# Altium schematic sheet CW308_Connectors.SchDoc: IO Connectors
size Letter; ApprovedBy: N; Organization: NewAE Technology Inc.; Address1: 1083 Queen St., Suite 196; Address2: Halifax; Address3: NS; Address4: Canada B3H 0B2; DocumentNumber: 2; SheetNumber: 2; SheetTotal: 5; SheetApproved: YES
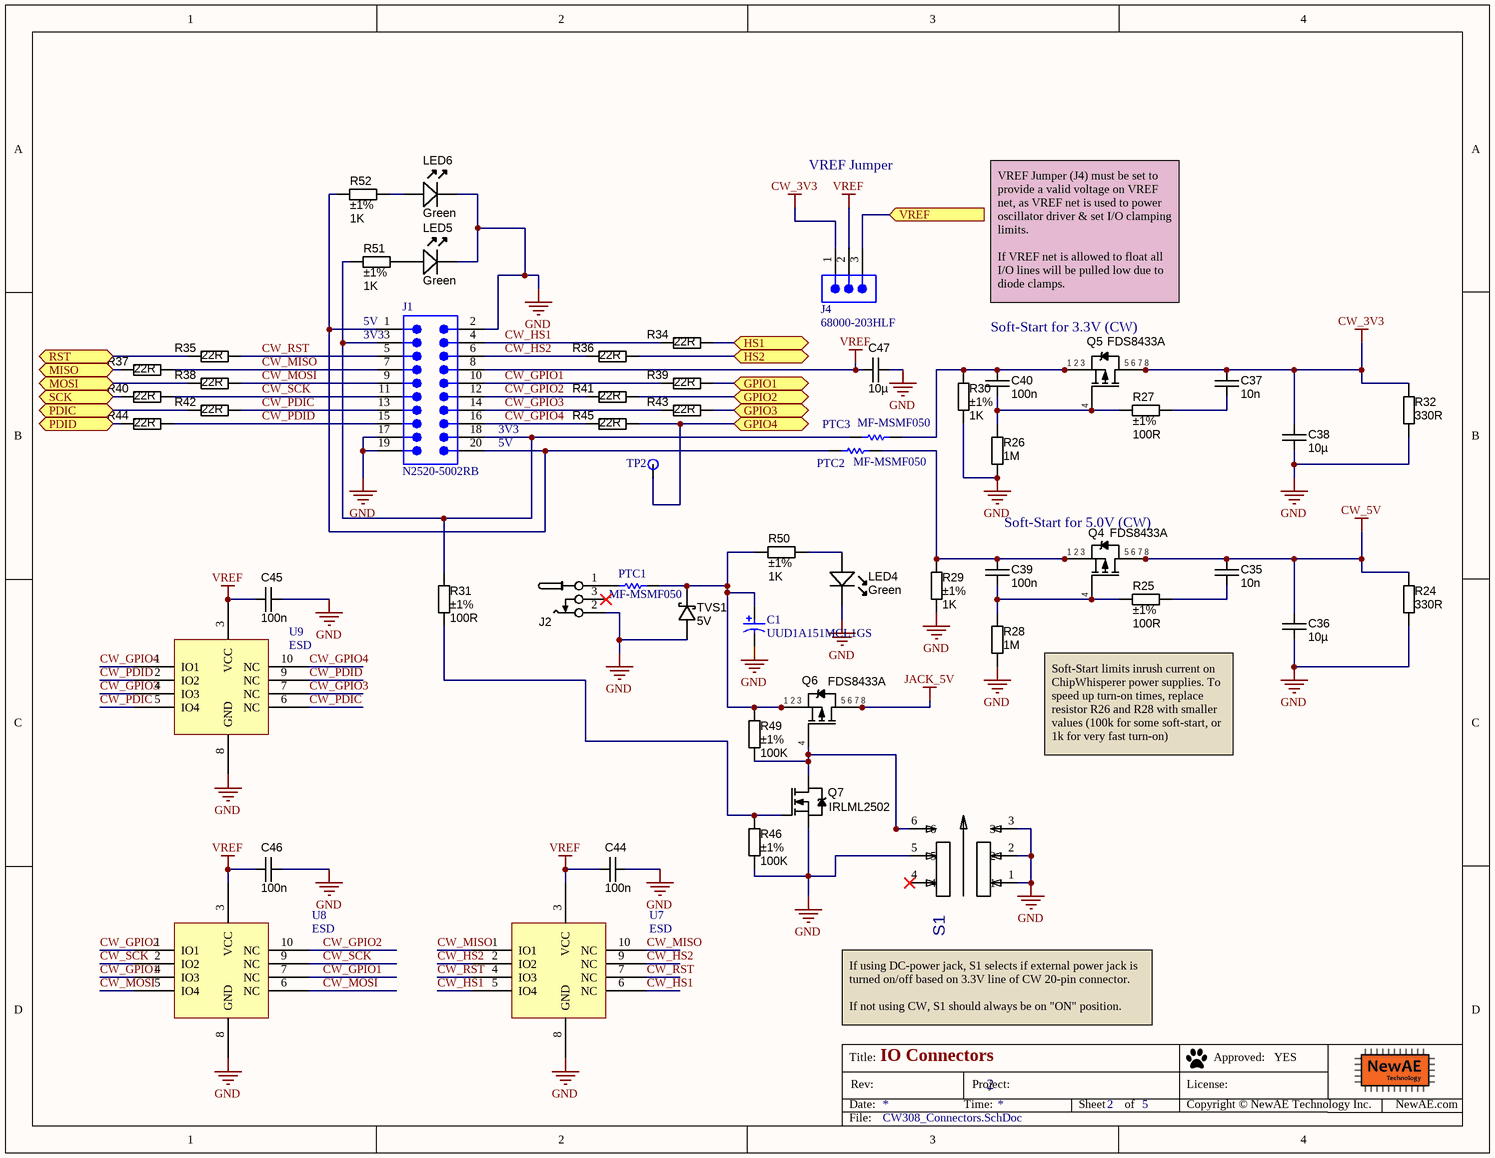
[diagram p0: CW308_Connectors.SchDoc]

## Parts
C1  UUD1A151MCL1GS  [NIC-CAPA2-6.3X5.8_V]
C35  value 10n  [CAPC1608X90N]  (hidden comment: approved sub OK)
C36  value 10µ  [CAPC2012X135N]  (hidden comment: approved sub OK)
C37  value 10n  [CAPC1608X90N]  (hidden comment: approved sub OK)
C38  value 10µ  [CAPC2012X135N]  (hidden comment: approved sub OK)
C39  value 100n  [CAPC1608X90N]  (hidden comment: approved sub OK)
C40  value 100n  [CAPC1608X90N]  (hidden comment: approved sub OK)
C44  value 100n  [CAPC1608X90N]  (hidden comment: approved sub OK)
C45  value 100n  [CAPC1608X90N]  (hidden comment: approved sub OK)
C46  value 100n  [CAPC1608X90N]  (hidden comment: approved sub OK)
C47  value 10µ  [CAPC2012X135N]  (hidden comment: approved sub OK)
J1  N2520-5002RB  [NAE-PCB-CW-1000-0001-01]
J2  CONN_PWR_JACK_2.1x5.5mm  [CONN_PWR_JACK_2.1x5.5mm]  (value not drawn)
J4  68000-203HLF  [SMTC-TSW-103-07-X-S]
LED4  Green  [LED-0603-GREEN]
LED5  Green  [LED-0603-GREEN]
LED6  Green  [LED-0603-GREEN]
PTC1  MF-MSMF050  [BOUR-MF-MSMF050-2_V]
PTC2  MF-MSMF050  [BOUR-MF-MSMF050-2_V]
PTC3  MF-MSMF050  [BOUR-MF-MSMF050-2_V]
Q4  FDS8433A  [SOIC127P600X175-8AN]
Q5  FDS8433A  [SOIC127P600X175-8AN]
Q6  FDS8433A  [SOIC127P600X175-8AN]
Q7  IRLML2502  [SOT23-3]
R24  value 330R  [RESC1608X55N]  (hidden comment: Thick Film)
R25  value 100R  Tolerance: ±1%  [RESC1608X55N]  (hidden comment: Thick Film)
R26  value 1M  [RESC1608X55N]  (hidden comment: Thick Film)
R27  value 100R  Tolerance: ±1%  [RESC1608X55N]  (hidden comment: Thick Film)
R28  value 1M  [RESC1608X55N]  (hidden comment: Thick Film)
R29  value 1K  Tolerance: ±1%  [RESC1608X55N]  (hidden comment: Thick Film)
R30  value 1K  Tolerance: ±1%  [RESC1608X55N]  (hidden comment: Thick Film)
R31  value 100R  Tolerance: ±1%  [RESC1608X55N]  (hidden comment: Thick Film)
R32  value 330R  [RESC1608X55N]  (hidden comment: Thick Film)
R34  value 22R  [RESC1608X55N]  (hidden comment: Thick Film)
R35  value 22R  [RESC1608X55N]  (hidden comment: Thick Film)
R36  value 22R  [RESC1608X55N]  (hidden comment: Thick Film)
R37  value 22R  [RESC1608X55N]  (hidden comment: Thick Film)
R38  value 22R  [RESC1608X55N]  (hidden comment: Thick Film)
R39  value 22R  [RESC1608X55N]  (hidden comment: Thick Film)
R40  value 22R  [RESC1608X55N]  (hidden comment: Thick Film)
R41  value 22R  [RESC1608X55N]  (hidden comment: Thick Film)
R42  value 22R  [RESC1608X55N]  (hidden comment: Thick Film)
R43  value 22R  [RESC1608X55N]  (hidden comment: Thick Film)
R44  value 22R  [RESC1608X55N]  (hidden comment: Thick Film)
R45  value 22R  [RESC1608X55N]  (hidden comment: Thick Film)
R46  value 100K  Tolerance: ±1%  [RESC1608X55N]  (hidden comment: Thick Film)
R49  value 100K  Tolerance: ±1%  [RESC1608X55N]  (hidden comment: Thick Film)
R50  value 1K  Tolerance: ±1%  [RESC1608X55N]  (hidden comment: Thick Film)
R51  value 1K  Tolerance: ±1%  [RESC1608X55N]  (hidden comment: Thick Film)
R52  value 1K  Tolerance: ±1%  [RESC1608X55N]  (hidden comment: Thick Film)
S1  JS202011SCQN  [SW_JS202011SCQN]  (value not drawn)
TP2  5008  [KEYSTONE5008]  (value not drawn)
TVS1  Ratings: 5V  [DO-214AC]  (hidden comment: DIODE_TVS_5V)
U7  ESD  [MSOP10]
U8  ESD  [MSOP10]
U9  ESD  [MSOP10]

## Ports
GPIO1 (bidir), GPIO2 (bidir), GPIO3 (bidir), GPIO4 (bidir), HS1 (bidir), HS2 (bidir), MISO (bidir), MOSI (bidir), PDIC (bidir), PDID (bidir), RST (bidir), SCK (bidir), VREF (in)

## Nets
CW_3V3: C37.1 C38.1 J4.1 Q5.5(5,6,7,8) Q5.6(D) Q5.7(D) Q5.8(D) R32.2
CW_5V: C35.1 C36.1 Q4.5(5,6,7,8) Q4.6(D) Q4.7(D) Q4.8(D) R24.2
GND: C1.2 C36.2 C38.2 C44.2 C45.2 C46.2 C47.2 J1.2 J1.17 J1.19 J2.2 LED4.K LED5.K LED6.K Q7.2(S) R24.1 R26.1 R28.1 R29.1 R30.1 R32.1 R46.2 S1.1 S1.2 S1.3 S1.5 TVS1.A U7.8(GND) U8.8(GND) U9.8(GND)
JACK_5V: Q6.5(5,6,7,8) Q6.6(D) Q6.7(D) Q6.8(D)
VREF: C44.1 C45.1 C46.1 C47.1 J1.8 J4.2 U7.3(VCC) U8.3(VCC) U9.3(VCC)
CW_GPIO1: J1.10 R39.1 U8.4(IO3) U8.7(NC)
CW_GPIO2: J1.12 R41.1 U8.1(IO1) U8.10(NC)
CW_GPIO3: J1.14 R43.1 U9.4(IO3) U9.7(NC)
CW_GPIO4: J1.16 R45.1 U9.1(IO1) U9.10(NC)
CW_HS1: J1.4 R34.1 U7.5(IO4) U7.6(NC)
CW_HS2: J1.6 R36.1 U7.2(IO2) U7.9(NC)
CW_MISO: J1.7 R37.2 U7.1(IO1) U7.10(NC)
CW_MOSI: J1.9 R38.2 U8.5(IO4) U8.6(NC)
CW_PDIC: J1.13 R42.2 U9.5(IO4) U9.6(NC)
CW_PDID: J1.15 R44.2 U9.2(IO2) U9.9(NC)
CW_RST: J1.5 R35.2 U7.4(IO3) U7.7(NC)
CW_SCK: J1.11 R40.2 U8.2(IO2) U8.9(NC)
GPIO1: R39.2 ; port GPIO1
GPIO2: R41.2 ; port GPIO2
GPIO3: R43.2 ; port GPIO3
GPIO4: R45.2 TP2.1 ; port GPIO4
HS1: R34.2 ; port HS1
HS2: R36.2 ; port HS2
MISO: R37.1 ; port MISO
MOSI: R38.1 ; port MOSI
PDIC: R42.1 ; port PDIC
PDID: R44.1 ; port PDID
RST: R35.1 ; port RST
SCK: R40.1 ; port SCK
VREF: J4.3 ; port VREF  [a separate net that carries the same name]
NetC1_1: C1.1 PTC1.2 Q6.1(1,2,3) Q6.2(S) Q6.3(S) R49.1 R50.2 TVS1.K
NetC35_2: C35.2 R25.2
NetC37_2: C37.2 R27.2
NetC39_1: C39.1 PTC2.2 Q4.1(1,2,3) Q4.2(S) Q4.3(S) R29.2
NetC39_2: C39.2 Q4.4(G) R25.1 R28.2
NetC40_1: C40.1 PTC3.2 Q5.1(1,2,3) Q5.2(S) Q5.3(S) R30.2
NetC40_2: C40.2 Q5.4(G) R26.2 R27.1
NetJ1_1: J1.1 J1.20 PTC2.1 R52.2
NetJ1_3: J1.3 J1.18 PTC3.1 R31.2 R51.2
NetJ2_1: J2.1 PTC1.1
NetLED4_A: LED4.A R50.1
NetLED5_A: LED5.A R51.1
NetLED6_A: LED6.A R52.1
NetQ6_4: Q6.4(G) Q7.3(D) R49.2 S1.6
NetQ7_1: Q7.1(G) R31.1 R46.1

Not connected (* = marked no-connect by the designer): J2 3*; S1 4*

## Notes on the sheet
- VREF Jumper
- VREF Jumper (J4) must be set to provide a valid voltage on VREF net, as VREF net is used to power oscillator driver & set I/O clamping limits.
  If VREF net is allowed to float all I/O lines will be pulled low due to diode clamps.
- (near J1) 5V
- (near J1) 3V3
- Soft-Start for 3.3V (CW)
- Soft-Start for 5.0V (CW)
- Soft-Start limits inrush current on ChipWhisperer power supplies. To speed up turn-on times, replace resistor R26 and R28 with smaller values (100k for some soft-start, or 1k for very fast turn-on)
- If using DC-power jack, S1 selects if external power jack is turned on/off based on 3.3V line of CW 20-pin connector.
  If not using CW, S1 should always be on "ON" position.
- Title:
- Date:
- Rev:
- Time:
- Project:
- Sheet
- of
- License:
- Copyright © NewAE Technology Inc.
- Approved:
- NewAE.com
- File:

## Library data of the parts
C1 = CMP-0687-00052-1: Aluminum Electrolytic Capacitor, UD Series, Low Impedance, 150 uF, 10 V, + / - 20%, -55 to 105 degC, Chip Type, 6.3 x 5.8 mm D x L, Pb-Free, Reel; Manufacturer: Nichicon; Tolerance Rated Capacitance: -20 to 20%; Endurance Time: 2000 h; Rated Voltage: 10 V; Impedance: 0.44 Ohm; Rated Capacitance: 150 uF; Rated Ripple Current (at 100kHz): 230 mA; Packing: Dia382mm Reel; RoHS: TRUE; ComponentLink1URL: http://www.nichicon.co.jp/; Mounting Technology: Surface Mount; Length: 5.8 mm; ComponentLink3URL: http://products.nichicon.co.jp/en/pdf/XJA043/e-ud.pdf; ComponentLink1Description: Manufacturer URL; ComponentLink2URL: http://products.nichicon.co.jp/en/pdf/XJA043/e-ud.pdf; DatasheetVersion: 08/2012; ComponentLink3Description: Package Specification; ComponentLink2Description: Datasheet; PartNumber: UUD1A151MCL1GS; Diameter: 6.3 mm; PackageDescription: 2-Pin Surface Mount Device, Diameter 6.3 mm, Height 5.8 mm, Pitch 5.4 mm; PackageReference: CAPAE-D6.3H5.8; Supplier 1: Digi-Key; Supplier Part Number 1: 493-2249-1-ND
C35 C37 = CAPC_10n_0603_X7R_50V_10%: Capacitor SMD Cer 10nF 10% 50V X7R 0603; Manufacturer 1: TDK Corporation; Manufacturer Part Number 1: C1608X7R1H103K; Ratings: 50V; X7R; Material: ceramic; SCDType: spec; Package / Case: 0603 (1608 metric); Tolerance: ±10%; Supplier 1: Digi-Key; Supplier Part Number 1: 445-1311-1-ND; ComponentLink1URL: http://product.tdk.com/capacitor/mlcc/en/documents/mlcc_commercial_general_en.pdf; ComponentLink1Description: http://product.tdk.com/capacitor/mlcc/en/documents/mlcc_commercial_general_en.pdf; Supplier 2: Digi-Key; Supplier Part Number 2: 478-1227-1-ND; Manufacturer 2: AVX Corporation; Manufacturer Part Number 2: 06035C103KAT2A; ComponentLink2URL: http://www.avx.com/docs/Catalogs/cx7r.pdf; ComponentLink2Description: http://www.avx.com/docs/Catalogs/cx7r.pdf
C36 C38 C47 = CAPC_10u_0805_10V: Capacitor SMD Cer 10uF 10% 10V X5R 0805; Manufacturer 1: AVX Corporation; Manufacturer Part Number 1: 0805ZD106KAT2A; Ratings: 10V; X5R; Material: ceramic; SCDType: spec; Package / Case: 0805 (2012 metric); Tolerance: ±10%; Manufacturer 2: Kemet; Manufacturer Part Number 2: C0805C106K8PACTU; Supplier 1: Digi-Key; Supplier Part Number 1: 478-5167-1-ND; ComponentLink1URL: http://www.avx.com/docs/Catalogs/cx5r.pdf; ComponentLink1Description: http://www.avx.com/docs/Catalogs/cx5r.pdf; ComponentLink2URL: http://www.kemet.com/datasheets&C0805C106K8PACTU; ComponentLink2Description: http://www.kemet.com/datasheets&C0805C106K8PACTU; Supplier 2: Digi-Key; Supplier Part Number 2: 399-4925-1-ND
C39 C40 C44-C46 = CAPC_100n_0603_X7R_50V_10%: Capacitor SMD Cer 100nF 10% 50V X7R 0603; Manufacturer 1: AVX Corporation; Manufacturer Part Number 1: 06035C104KAT2A; Ratings: 50V; X7R; Material: ceramic; SCDType: spec; Manufacturer 2: TDK Corporation; Manufacturer Part Number 2: C1608X7R1H104K; Package / Case: 0603 (1608 Metric); Tolerance: ±10%; Supplier 1: Digi-Key; Supplier Part Number 1: 478-5052-1-ND; ComponentLink1URL: http://www.avx.com/docs/Catalogs/cx7r.pdf; ComponentLink1Description: http://www.avx.com/docs/Catalogs/cx7r.pdf; Supplier 2: Digi-Key; Supplier Part Number 2: 445-1314-1-ND; ComponentLink2URL: http://product.tdk.com/capacitor/mlcc/en/documents/mlcc_commercial_general_en.pdf; ComponentLink2Description: http://product.tdk.com/capacitor/mlcc/en/documents/mlcc_commercial_general_en.pdf
J1 = NAE-CW-1000-0001-01: 20 Pin R/A Shrouded Header; Manufacturer: 3M; Pitch: 2.54 mm; PackageReference: N2520-5002RB; PackageDescription: .100[2.54] High Temp Terminal Body (Board Stacking); Orientation: Vertical; RoHS: True; Temperature Range: -55 to 125 degC; Mounting Technology: Through-hole; PartNumber: N2520-5002RB; Supplier 1: Digi-Key; Supplier Part Number 1: MHE20K-ND
J2 = CONN_PWR_JACK_2.1x5.5mm: Power Connector, THT, 2.1mm ID, 5.5mm OD; Manufacturer 1: CUI Inc; Manufacturer Part Number 1: PJ-102AH; SCDType: undef; Category: Connectors; Mounting Type: Through Hole; Package / Case: PCB mount; Value: 2.1mm ID, 5.5mm OD; Supplier 1: Digi-Key; Supplier Part Number 1: CP-102AH-ND
J4 = CMP-1024-00333-1: Manufacturer: Samtec; Pitch: 2.54 mm; Temperature Range: -55 to 125 degC; RoHS: True; Orientation: Vertical; PackageDescription: .025[0.64] SQ. Post Terminal Strip Assembly; Mounting Technology: Through-hole; PartNumber: 68000-203HLF; Supplier 1: Digi-Key; Supplier Part Number 1: 609-3464-ND
LED4-LED6 = LED_SMD_Green_0603_570nm: LED 0603 SMD Green 570nm 50mcd 20mA; Manufacturer 1: Kingbright Company LLC; Manufacturer Part Number 1: APT1608CGCK; Material: AlGaInP; Ratings: 20mcd min; 50 mcd typ; 570 nm; Voltage - Forward (Vf) Typ: 2.1V; Viewing Angle: 120°; Lens Style/Size: Rectangle with Flat Top, 1.1mm x 0.8mm; Voltage - Forward (Vf) @ 10mA: 2.0V; SCDType: source; Wavelength - Peak: 574nm; Lens Type: Clear; Package / Case: 0603 (1608 metric); Color: Green; Current - Test: 20mA; Supplier 1: Digi-Key; Supplier Part Number 1: 754-1116-1-ND; RoHS 1: RoHS Compliant; Wavelength - Dominant: 570nm; ComponentLink1URL: http://www.us.kingbright.com/images/catalog/SPEC/APT1608CGCK.pdf; ComponentLink1Description: http://www.us.kingbright.com/images/catalog/SPEC/APT1608CGCK.pdf
PTC1-PTC3 = CMP-0280-00002-2: MF-MSMF Series - PTC Resettable Fuse, 15 V Max, 0.15 Ohm Min, -40 to 85 degC, RoHS, Reel; Manufacturer: Bourns; Voltage DC (Max): 15 V; Trip Current: 1 A; Hold Current: 0.5 A; Current Rating (Max): 100 A; ComponentLink1Description: Manufacturer URL; Operating Temperature Range: -40 to 85 degC; ComponentLink2URL: http://www.bourns.com/data/global/pdfs/mfmsmf.pdf; PackageReference: MF-MSMF050; ComponentLink2Description: Datasheet; PartNumber: MF-MSMF050; DatasheetVersion: Rev. AD; ComponentLink3URL: http://www.bourns.com/data/global/pdfs/mfmsmf.pdf; ComponentLink3Description: Package Specification; RoHS: TRUE; PackageDescription: 2-Pin SMD, Body 4.55 x 3.24 mm; Mounting Technology: Surface Mount; Packing: Reel; Resistance (Min): 0.15 Ohm; ComponentLink1URL: http://www.bourns.com/; Supplier 1: Digi-Key; Supplier Part Number 1: MF-MSMF050-2CT-ND
Q4-Q6 = MOSFET_FDS8433A: MOSFET P-CH 30V 13.7A SOIC-8 SMD, LL-Gate Drive; Manufacturer 1: Fairchild Semiconductor; Material: Silicon; Ratings: 30V; 5A; SCDType: source; Package / Case: SOIC-8; Manufacturer Part Number 1: FDS8433A; ComponentLink1Description: Datasheet; ComponentLink1URL: http://www.fairchildsemi.com/datasheets/FD/FDS8433A.pdf; Supplier 1: Digi-Key; Supplier Part Number 1: FDS8433ACT-ND
Q7 = MOSFET_IRLML2502: MOSFET SMD N-CH 20V 4.2A SOT23-3; Manufacturer 1: Diodes Inc; Manufacturer Part Number 1: IRLML2502TRPBF; Ratings: 20V; 4.2A; Material: Metal Oxide; SCDType: source; Package / Case: SOT23-3; Supplier 1: Digi-Key; Supplier Part Number 1: IRLML2502PBFCT-ND
R24 R32 = RES_330R_0603_5%: Resistor SMD chip 330 Ohm 0.1W 5% 0603; Manufacturer 1: Vishay Dale; Manufacturer Part Number 1: CRCW0603330RJNEA; Ratings: 1/10 W; SCDType: spec; Manufacturer 2: Yageo; Manufacturer Part Number 2: RC0603JR-07330RL; Package / Case: 0603 (1608 metric); Tolerance: ±5%; Material: Thick Film; Supplier 1: Digi-Key; Supplier Part Number 1: 541-330GCT-ND; ComponentLink1URL: http://www.vishay.com/doc?20035; ComponentLink1Description: http://www.vishay.com/doc?20035; Supplier 2: Digi-Key; Supplier Part Number 2: 311-330GRCT-ND; ComponentLink2URL: http://www.yageo.com/documents/recent/PYu-RC0603_51_RoHS_L_4.pdf; ComponentLink2Description: http://www.yageo.com/documents/recent/PYu-RC0603_51_RoHS_L_4.pdf
R25 R27 R31 = RES_100R_0603_1%: Resistor SMD chip 100 Ohm 0.1W 1% 0603; Manufacturer 1: Yageo; Manufacturer Part Number 1: RC0603FR-07100RL; Ratings: 1/10 W; SCDType: spec; Package / Case: 0603 (1608 Metric); Material: Thick Film; Supplier 1: Digi-Key; Supplier Part Number 1: 311-100HRCT-ND; Supplier 2: Digi-Key; Supplier Part Number 2: P100HTR-ND; Manufacturer 2: Panasonic - ECG; Manufacturer Part Number 2: ERJ-3EKF1000V; ComponentLink1URL: http://industrial.panasonic.com/www-cgi/jvcr13pz.cgi?E+PZ+3+AOA0002+ERJ3EKF1000V+7+WW; ComponentLink1Description: http://industrial.panasonic.com/www-cgi/jvcr13pz.cgi?E+PZ+3+AOA0002+ERJ3EKF1000V+7+WW
R26 R28 = RES_1M_0603_5%: Resistor SMD chip 1M Ohm 0.1W 5% 0603; Manufacturer 1: Vishay Dale; Manufacturer Part Number 1: CRCW06031M00JNEA; Ratings: 1/10 W; SCDType: spec; Package / Case: 0603 (1608 metric); Tolerance: ±5%; Material: Thick Film; Supplier 1: Digi-Key; Supplier Part Number 1: 541-1.0MGCT-ND; ComponentLink1URL: http://www.vishay.com/doc?20008; ComponentLink1Description: http://www.vishay.com/doc?20008; Supplier 2: Digi-Key; Supplier Part Number 2: 311-1.0MGRCT-ND; ComponentLink2URL: http://www.yageo.com/documents/recent/PYu-RC0603_51_RoHS_L_4.pdf; ComponentLink2Description: http://www.yageo.com/documents/recent/PYu-RC0603_51_RoHS_L_4.pdf; Manufacturer 2: Yageo; Manufacturer Part Number 2: RC0603JR-071ML
R29 R30 R50-R52 = RES_1K_0603_1%: Resistor SMD chip 1k Ohm 0.1W 1% 0603; Manufacturer 1: Yageo; Manufacturer Part Number 1: RC0603FR-071KL; Ratings: 1/10W; SCDType: spec; Package / Case: 0603 (1608 Metric); Supplier 1: Digi-Key; Supplier Part Number 1: 311-1.00KHRCT-ND
R34-R45 = RES_22R_0603_5%: Resistor SMD chip 22 Ohm 0.1W 5% 0603; Manufacturer 1: Yageo; Manufacturer Part Number 1: RC0603JR-0722RL; Ratings: 1/10W; SCDType: spec; Temperature Coefficient: ±100ppm/°C; Tolerance: ±5%; Package / Case: 0603 (1608 metric); Case: 0603 (1608 metric); Supplier 1: Digi-Key; Supplier Part Number 1: 311-22GRCT-ND; RoHS 1: RoHS Compliant; ComponentLink1URL: http://www.yageo.com/documents/recent/PYu-RC0603_51_RoHS_L_4.pdf; ComponentLink1Description: http://www.yageo.com/documents/recent/PYu-RC0603_51_RoHS_L_4.pdf; Supplier 2: Digi-Key; Supplier Part Number 2: 1276-5022-6-ND; Manufacturer 2: Samsung Electro-Mechanics America, Inc; Manufacturer Part Number 2: RC1608J220CS; RoHS 2: RoHS Compliant; ComponentLink2URL: http://www.samsungsem.com/servlet/FileDownload?filename=productcatalog/pdf/Chip_Resistor.pdf; ComponentLink2Description: http://www.samsungsem.com/servlet/FileDownload?filename=productcatalog/pdf/Chip_Resistor.pdf; Supplier 3: Digi-Key; Supplier Part Number 3: RMCF0603JT22R0DKR-ND; Manufacturer 3: Stackpole Electronics Inc; Manufacturer Part Number 3: RMCF0603JT22R0; RoHS 3: RoHS Compliant; ComponentLink3URL: http://www.seielect.com/Catalog/SEI-RMCF_RMCP.pdf; ComponentLink3Description: http://www.seielect.com/Catalog/SEI-RMCF_RMCP.pdf; Supplier 4: Digi-Key; Supplier Part Number 4: RHM22CGDKR-ND; Manufacturer 4: Rohm Semiconductor; Manufacturer Part Number 4: MCR03ERTJ220; RoHS 4: RoHS Compliant; ComponentLink4URL: http://rohmfs.rohm.com/en/products/databook/datasheet/passive/resistor/chip_resistor/mcr_g.pdf; ComponentLink4Description: http://rohmfs.rohm.com/en/products/databook/datasheet/passive/resistor/chip_resistor/mcr_g.pdf; Supplier 5: Digi-Key; Supplier Part Number 5: P22GDKR-ND; Manufacturer 5: Panasonic Electronic Components; Manufacturer Part Number 5: ERJ-3GEYJ220V; RoHS 5: RoHS Compliant; ComponentLink5URL: http://industrial.panasonic.com/www-cgi/jvcr13pz.cgi?E+PZ+3+AOA0001+ERJ3GEYJ220V+7+WW; ComponentLink5Description: http://industrial.panasonic.com/www-cgi/jvcr13pz.cgi?E+PZ+3+AOA0001+ERJ3GEYJ220V+7+WW
R46 R49 = RES_100K_0603_1%: Resistor SMD chip 100k Ohm 0.1W 1% 0603; Manufacturer 1: Vishay/Dale; Manufacturer Part Number 1: CRCW0603100KFKEA; Ratings: 1/10W; SCDType: spec; Package / Case: 0603 (2012 metric); Supplier 1: Digi-Key; Supplier Part Number 1: 541-100KHCT-ND
S1 = JS202011SCQN: DPDT SMD Switch, 300mA; Manufacture 1: C&K Components; Value: DPDT; Supplier 1: Digi-Key; Manufacture Part Number 1: JS202011SCQN; Supplier Part Number 1: 401-2002-1-ND
TP2 = KEYSTONE_5008: TEST POINT PC COMPACT .063"D ORG; Supplier 1: Digi-Key; Supplier Part Number 1: 36-5008-ND
TVS1 = DIODE_TVS_5V: TVS SMA; Manufacturer 1: Littlefuse Inc; Manufacturer Part Number 1: SMAJ5.0A; Diode Type: Schottky; Speed: Fast Recovery =< 500ns, > 200mA (Io); SCDType: source; Package / Case: DO-214AC, SMA; Material: Si; Mounting Type: Surface Mount; Supplier 1: Digi-Key; Supplier Part Number 1: SMAJ5.0ALFCT-ND
U7-U9 = SP3003-04ATG: Manufacture Part Number 1: SP3003-04ATG; Supplier 1: Digi-Key; Supplier Part Number 1: F3303CT-ND